# Altium schematic sheet 105358-3SC002-01-A_PWR_MGMT.SchDoc: Power Management
size 420 x 297 mm; DrawnBy: JeSa, KaKa; Organization: Hotswap Norden AB; Address1: Knarrarnäsgatan 7; Address2: SE-164 40 Kista; Address3: Sweden; DocumentNumber: 105358-3SC001-01; SheetNumber: 3; SheetTotal: 5; PageSetup: Record=PageOptions|CenterHorizontal=True|CenterVertical=True|PrintScale=0.96|XCorrection=1.00|YCorrection=1.00|PrintKind=0|BorderSize=5000000|LeftOffset=0|BottomOffset=0|Orientation=2|PaperLength=1000|PaperWidth=1000|Scale=100|PaperSource=7|PrintQuality=-4|MediaType=1|DitherType=10|PaperKind=A3|PrintScaleMode=1
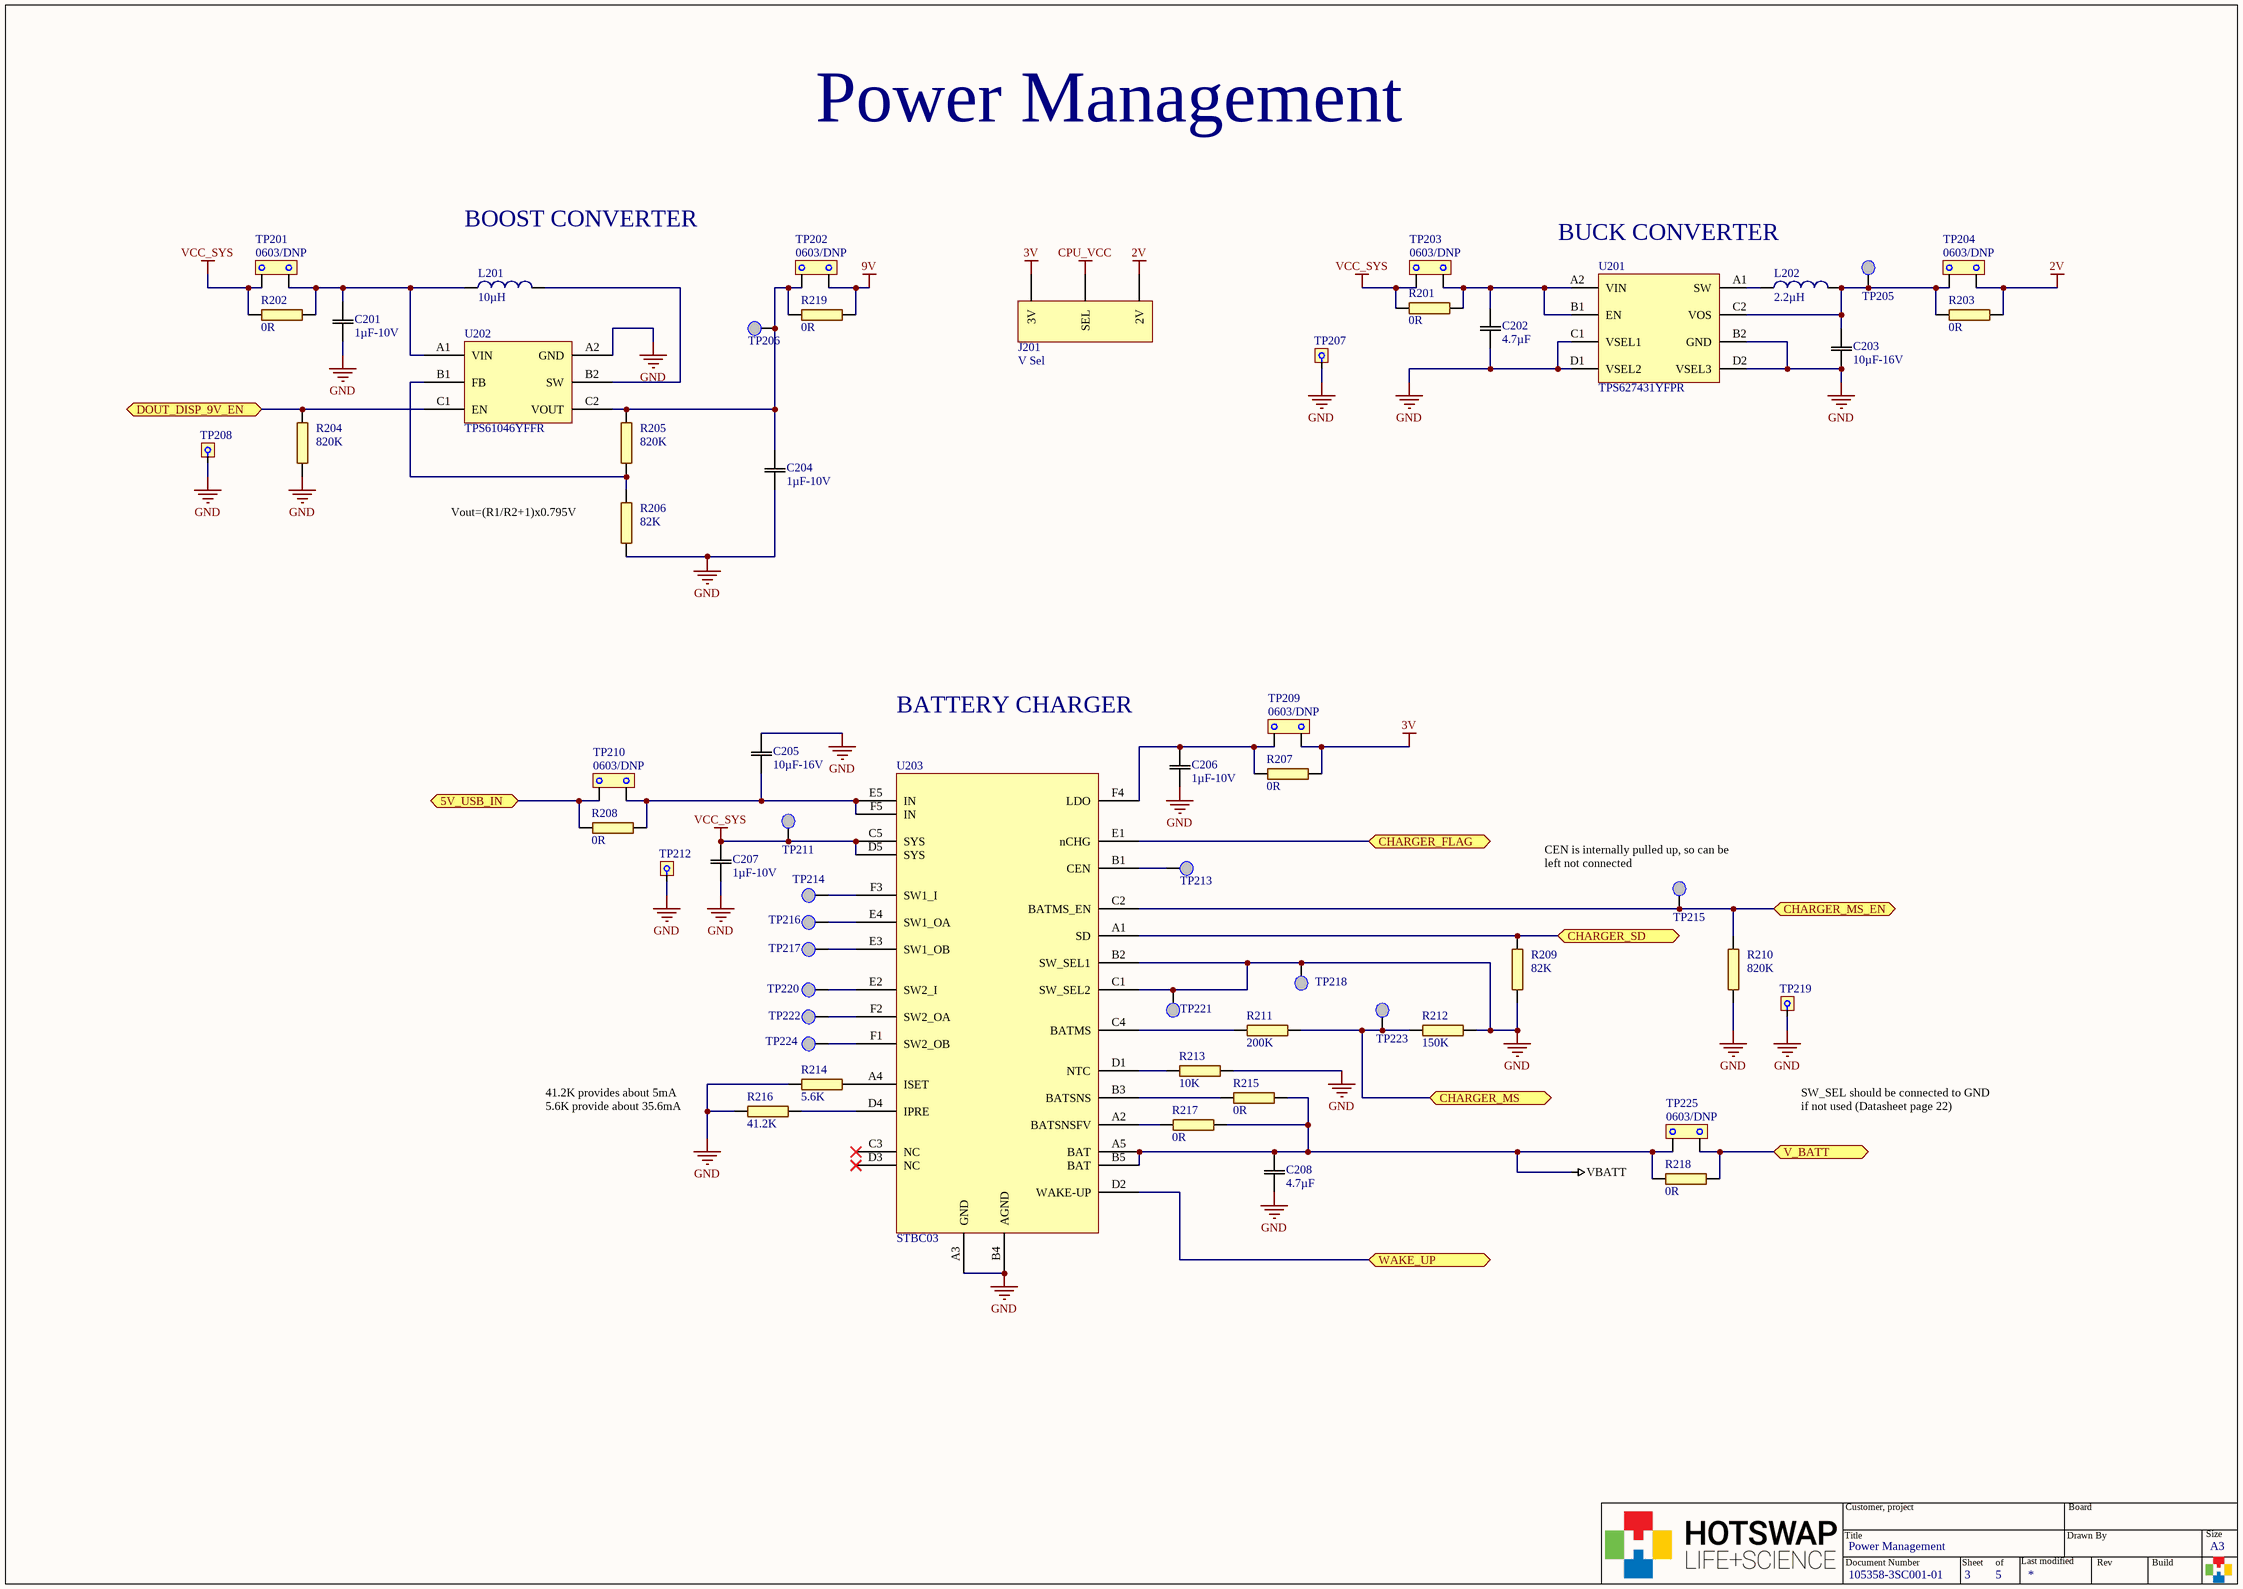
[diagram p0: 105358-3SC002-01-A_PWR_MGMT.SchDoc]

## Parts
C201  1µF-10V  [0402C_HIGH_DENSITY]
C202  4.7µF  [0402C_HIGH_DENSITY]
C203  10µF-16V  [0603C_HIGH_DENSITY]
C204  1µF-10V  [0402C_HIGH_DENSITY]
C205  10µF-16V  [0603C_HIGH_DENSITY]
C206  1µF-10V  [0402C_HIGH_DENSITY]
C207  1µF-10V  [0402C_HIGH_DENSITY]
C208  4.7µF  [0402C_HIGH_DENSITY]
J201  V Sel  [Pin Header 3 x 1 - 2.54mm]
L201  10µH  [0805L_HIGH_DENSITY]
L202  2.2µH  [0805L_HIGH_DENSITY]
R201  0R  [0603R-GENRIC]
R202  0R  [0603R-GENRIC]
R203  0R  [0603R-GENRIC]
R204  820K  [0402R-GENERIC]
R205  820K  [0402R-GENERIC]
R206  82K  [0402R-GENERIC]
R207  0R  [0603R-GENRIC]
R208  0R  [0603R-GENRIC]
R209  82K  [0402R-GENERIC]
R210  820K  [0402R-GENERIC]
R211  200K  [0402R-GENERIC]
R212  150K  [0402R-GENERIC]
R213  10K  [0402R-GENERIC]
R214  5.6K  [0603R-GENRIC]
R215  0R  [0603R-GENRIC]
R216  41.2K  [0603R-GENRIC]
R217  0R  [0603R-GENRIC]
R218  0R  [0603R-GENRIC]
R219  0R  [0603R-GENRIC]
TP201  0603/DNP  [TESTPOINT_C_R0608]  (no BOM)
TP202  0603/DNP  [TESTPOINT_C_R0608]  (no BOM)
TP203  0603/DNP  [TESTPOINT_C_R0608]  (no BOM)
TP204  0603/DNP  [TESTPOINT_C_R0608]  (no BOM)
TP205  TEST POINT  [PAD TEST POINT]  (value not drawn)  (no BOM)
TP206  TEST POINT  [PAD TEST POINT]  (value not drawn)  (no BOM)
TP207  TP_V_HOOK  [Testpoint_Hook]  (value not drawn)  (no BOM)
TP208  TP_V_HOOK  [Testpoint_Hook]  (value not drawn)  (no BOM)
TP209  0603/DNP  [TESTPOINT_C_R0608]  (no BOM)
TP210  0603/DNP  [TESTPOINT_C_R0608]  (no BOM)
TP211  TEST POINT  [PAD TEST POINT]  (value not drawn)  (no BOM)
TP212  TP_V_HOOK  [Testpoint_Hook]  (value not drawn)  (no BOM)
TP213  TEST POINT  [PAD TEST POINT]  (value not drawn)  (no BOM)
TP214  TEST POINT  [PAD TEST POINT]  (value not drawn)  (no BOM)
TP215  TEST POINT  [PAD TEST POINT]  (value not drawn)  (no BOM)
TP216  TEST POINT  [PAD TEST POINT]  (value not drawn)  (no BOM)
TP217  TEST POINT  [PAD TEST POINT]  (value not drawn)  (no BOM)
TP218  TEST POINT  [PAD TEST POINT]  (value not drawn)  (no BOM)
TP219  TP_V_HOOK  [Testpoint_Hook]  (value not drawn)  (no BOM)
TP220  TEST POINT  [PAD TEST POINT]  (value not drawn)  (no BOM)
TP221  TEST POINT  [PAD TEST POINT]  (value not drawn)  (no BOM)
TP222  TEST POINT  [PAD TEST POINT]  (value not drawn)  (no BOM)
TP223  TEST POINT  [PAD TEST POINT]  (value not drawn)  (no BOM)
TP224  TEST POINT  [PAD TEST POINT]  (value not drawn)  (no BOM)
TP225  0603/DNP  [TESTPOINT_C_R0608]  (no BOM)
U201  TPS627431YFPR  [TPS627431YFPR]
U202  TPS61046YFFR  [TPS61046YFFR]
U203  STBC03  [STBC03]

## Ports
5V_USB_IN, CHARGER_FLAG, CHARGER_MS, CHARGER_MS_EN, CHARGER_SD, DOUT_DISP_9V_EN, V_BATT, WAKE_UP

## Nets
2V: J201.3(2V) R203.2 TP204.2
3V: J201.1(3V) R207.2 TP209.2
9V: R219.2 TP202.2
CPU_VCC: J201.2(SEL)
GND: C201.1 C202.1 C203.1 C204.1 C205.2 C206.1 C207.1 C208.1 R204.2 R206.2 R209.2 R210.2 R212.2 R213.2 R214.1 R216.1 TP207.1 TP208.1 TP212.1 TP218.1(Test_Point) TP219.1 TP221.1(Test_Point) U201.B2(GND) U201.C1(VSEL1) U201.D1(VSEL2) U201.D2(VSEL3) U202.A2(GND) U203.A3(GND) U203.B2(SW_SEL1) U203.B4(AGND) U203.C1(SW_SEL2)
VBATT: C208.2 R215.2 R217.2 R218.1 TP225.1 U203.A5(BAT) U203.B5(BAT)
VCC_SYS: C207.2 R201.1 R202.1 TP201.1 TP203.1 TP211.1(Test_Point) U203.C5(SYS) U203.D5(SYS)
5V_USB_IN: R208.1 TP210.1 ; port 5V_USB_IN
CHARGER_FLAG: U203.E1(nCHG) ; port CHARGER_FLAG
CHARGER_MS: R211.2 R212.1 TP223.1(Test_Point) ; port CHARGER_MS
CHARGER_MS_EN: R210.1 TP215.1(Test_Point) U203.C2(BATMS_EN) ; port CHARGER_MS_EN
CHARGER_SD: R209.1 U203.A1(SD) ; port CHARGER_SD
DOUT_DISP_9V_EN: R204.1 U202.C1(EN) ; port DOUT_DISP_9V_EN
V_BATT: R218.2 TP225.2 ; port V_BATT
WAKE_UP: U203.D2(WAKE-UP) ; port WAKE_UP
NetC201_2: C201.2 L201.1 R202.2 TP201.2 U202.A1(VIN)
NetC202_2: C202.2 R201.2 TP203.2 U201.A2(VIN) U201.B1(EN)
NetC203_2: C203.2 L202.2 R203.1 TP204.1 TP205.1(Test_Point) U201.C2(VOS)
NetC204_2: C204.2 R205.1 R219.1 TP202.1 TP206.1(Test_Point) U202.C2(VOUT)
NetC205_1: C205.1 R208.2 TP210.2 U203.E5(IN) U203.F5(IN)
NetC206_2: C206.2 R207.1 TP209.1 U203.F4(LDO)
NetL201_2: L201.2 U202.B2(SW)
NetL202_1: L202.1 U201.A1(SW)
NetR205_2: R205.2 R206.1 U202.B1(FB)
NetR211_1: R211.1 U203.C4(BATMS)
NetR213_1: R213.1 U203.D1(NTC)
NetR214_2: R214.2 U203.A4(ISET)
NetR215_1: R215.1 U203.B3(BATSNS)
NetR216_2: R216.2 U203.D4(IPRE)
NetR217_1: R217.1 U203.A2(BATSNSFV)
NetTP213_1: TP213.1(Test_Point) U203.B1(CEN)
NetTP214_1: TP214.1(Test_Point) U203.F3(SW1_I)
NetTP216_1: TP216.1(Test_Point) U203.E4(SW1_OA)
NetTP217_1: TP217.1(Test_Point) U203.E3(SW1_OB)
NetTP220_1: TP220.1(Test_Point) U203.E2(SW2_I)
NetTP222_1: TP222.1(Test_Point) U203.F2(SW2_OA)
NetTP224_1: TP224.1(Test_Point) U203.F1(SW2_OB)

Not connected (* = marked no-connect by the designer): U203 C3(NC)* D3(NC)*

## Notes on the sheet
- Power Management
- BOOST CONVERTER
- BUCK CONVERTER
- (near R206) Vout=(R1/R2+1)x0.795V
- BATTERY CHARGER
- (near TP215) CEN is internally pulled up, so can be left not connected
- 41.2K provides about 5mA
  5.6K provide about 35.6mA
- SW_SEL should be connected to GND
  if not used (Datasheet page 22)
- Title
- Customer, project
- Drawn By
- Board
- Size
- Document Number
- Sheet
- of
- Last modified
- Rev
- Build
- A3

## Library data of the parts
C201 C204 C206 C207 = 0402C-1uF-10V: 1µF ±10% 10V X5R Ceramic Capacitor 0402; Manufacturer Part Number: CC0402KRX5R6BB105; Manufacturer: Yageo; Capacitance: 1µF; Digi-Key Part Number: 311-1439-1-ND; PackageReference: 0402; Temperature Coefficient: X5R; Tolerance: 10%; Voltage - Rated: 10V
C202 C208 = 0402C-4.7uF-6.3V: 4.7µF ±10% 6.3V X5R Ceramic Capacitor 0402; Manufacturer Part Number: C1005X5R0J475K050BC; Manufacturer: TDK Corporation; Capacitance: 4.7µF; Digi-Key Part Number: 445-5947-1-ND; PackageReference: 0402; Temperature Coefficient: X5R; Tolerance: 10%; Voltage - Rated: 6.3V
C203 C205 = 0603C-10uF-16V: 16µF ±10% 16V X5R Ceramic Capacitor 0603; Manufacturer Part Number: GRT188R61C106KE13D; Manufacturer: Murata Electronics North America; Capacitance: 10µF; Digi-Key Part Number: 490-12317-1-ND; PackageReference: 0603; Temperature Coefficient: X5R; Tolerance: 10%; Voltage - Rated: 16V
J201 = CPU_V_SEL
L201 = 0805L-10uH-0.39Ohm: FIXED IND 10UH 500MA 300 MOHM; Manufacturer: TDK Corporation; Manufacturer Part Number: MLZ2012N100LT000; Number of Lines: 1; Current Rating (Max): 350mA; Tolerance: 20%; DCRDC Resistance (DCR): 390 mOhm Max; Digi-Key Part Number: 445-6762-1-ND; Impedance: 10µH; ComponentLink1Description: Datasheet; ComponentLink1URL: https://product.tdk.com/info/en/catalog/datasheets/inductor_commercial_decoupling_mlz2012_en.pdf; PackageReference: 0805
L202 = 0805L-2.2uH-0.2Ohm: FIXED IND 2.2UH 600MA 0.2OHM SMD; Manufacturer: TDK Corporation; Manufacturer Part Number: MLZ2012M2R2HTD25; Number of Lines: 1; Tolerance: 20%; Digi-Key Part Number: 445-17077-1-ND; Impedance: 2.2µH; Current Rating (Max): 600mA; ComponentLink1Description: Datasheet; ComponentLink1URL: https://www.digikey.com/product-detail/en/tdk-corporation/MLZ2012M2R2HTD25/445-17077-2-ND/4743205; PackageReference: 0805
R201-R203 R207 R208 R215 R217-R219 = 0603R-0R -1%-0.063W: RES SMD 0 OHM 1% 1/10W 0603; Power: 0.063W; GENERIC_OK: YES; Resistance (Ohms): 0R; PackageReference: 0603
R204 R205 R210 = 0402R-820k OHM-1%-0.063W: RES SMD 820kOHM 1% 1/16W 0402; Manufacturer: Yageo; Manufacturer Part Number: RC0402FR-07820KL; Power: 0.063W; GENERIC_OK: YES; Digi-Key Part Number: YAG3240CT-ND; Resistance (Ohms): 820KOhm; Tolerance: 1%; PackageReference: 0402
R206 R209 = 0402R-82k OHM-1%-0.063W: RES SMD 82kOHM 1% 1/16W 0402; Manufacturer: Yageo; Manufacturer Part Number: RC0402FR-0782KL; Power: 0.063W; GENERIC_OK: YES; Digi-Key Part Number: 311-82.0KLRCT-ND; Resistance (Ohms): 82KOhm; Tolerance: 1%; PackageReference: 0402
R211 = 0402R-200k OHM-1%-0.063W: RES SMD 200kOHM 1% 1/16W 0402; Manufacturer: Yageo; Manufacturer Part Number: AC0402FR-07200KL; Power: 0.063W; GENERIC_OK: YES; Digi-Key Part Number: YAG3452CT-ND; Resistance (Ohms): 200KOhm; Tolerance: 1%; PackageReference: 0402; Features: Moisture Resistant
R212 = 0402R-150k OHM-5%-0.063W: RES SMD 150kOHM 5% 1/16W 0402; Manufacturer: Yageo; Manufacturer Part Number: RC0402JR-07150KL; Power: 0.063W; GENERIC_OK: YES; Digi-Key Part Number: 311-150KJRCT-ND; Resistance (Ohms): 150KOhm; Tolerance: 5%; PackageReference: 0402; Features: Moisture Resistant
R213 = 0402R-10k OHM-1%-0.063W: RES SMD 10kOHM 1% 1/16W 0402; Manufacturer: Yageo; Manufacturer Part Number: RC0402FR-0710KL; Power: 0.063W; GENERIC_OK: YES; Digi-Key Part Number: 311-10.0KLRCT-ND; Resistance (Ohms): 10KOhm; Tolerance: 1%; PackageReference: 0402; Features: Moisture Resistant
R214 = 0603R-5.6k OHM-5%-0.063W: RES SMD 5.6kOHM 5% 1/16W 0603; Manufacturer: Yageo; GENERIC_OK: YES; Resistance (Ohms): 5.6KOhm; Tolerance: 5%; PackageReference: 0603
R216 = 0603R-41.2k OHM-1%: RES SMD 41.2kOHM 1% 0603; Manufacturer: Yageo; GENERIC_OK: YES; Resistance (Ohms): 41.2KOhm; Tolerance: 1%; PackageReference: 0402
TP201-TP204 TP209 TP210 TP225 = TP_C_R0603: Test point for Med Current 0402 JUMPER SMD O OHM 1% 1/4W 0603; ClassName: TP
TP205 TP206 TP211 TP213-TP218 TP220-TP224 = TEST POINT: Testing Poiny
TP207 TP208 TP212 TP219 = TP_V_HOOK: Black PC Test Point; Manufacturer: Keystone Electronics; Manufacturer Part Number: 5001; Digi-Key Part Number: 36-5001-ND
U201 = TPS627431YFPR: Buck Converter; Manufacturer: Texas Instruments; Output Configuration: Positive; Function: Step-Down; Voltage - Input (Min): 2.15V; Voltage - Input (Max): 5.5V; Voltage - Output (Min/Fixed): 1.3V; Voltage - Output (Max): 3.1V; Current - Output: 400mA; Frequency - Switching: 1.2MHz; Synchronous Rectifier: Yes; ComponentLink1URL: http://www.ti.com/lit/ds/symlink/tps62743.pdf; ComponentLink1Description: Datasheet; Manufacturer Part Number: TPS627431YFPR; PackageReference: 8-XFBGA, DSBGA; Digi-Key Part Number: 296-44499-2-ND
U202 = TPS61046YFFR: Boost converter 28V; Manufacturer: Texas Instruments; Voltage - Supply (Min): 1.8V; Voltage - Supply (Max): 5.5V; Voltage - Output: 4.5 V ~ 28 V; Current - Output / Channe: 1.2A (Switch); Frequency: 1.05MHz; Supplier 1: Digi-Key; Supplier Part Number 1: 296-44337-1-ND; ComponentLink1URL: http://www.ti.com/lit/ds/symlink/tps61046.pdf; ComponentLink1Description: Datasheet; Manufacturer Part Number: TPS61046YFFR; PackageReference: 6-UFBGA, DSBGA; Digi-Key Part Number: 296-44337-1-ND
U203 = STBC03: Li-Ion linear battery charger; Manufacturer Part Number: STBC03JR; Manufacturer: STMicroelectronics; Battery Chemistry: Lithium-Ion/Polymer; Battery Pack Voltag: 4.2V; Voltage - Supply (Max): 5.4V; Charge Current - Max: 650mA; ComponentLink1URL: http://www.st.com/content/ccc/resource/technical/document/datasheet/group3/05/ea/e8/4e/a7/a6/4a/c6/DM00338132/files/DM00338132.pdf/jcr:content/translations/en.DM00338132.pdf; ComponentLink1Description: Datasheet; PackageReference: 30-UFBGA, FCBGA; Digi-Key Part Number: 497-17241-1-ND